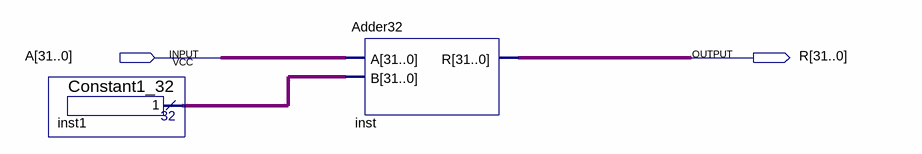
[diagram p0: schematic sheet]
// Quartus schematic Add1.bdf as structural Verilog: 2 symbols, 2 pins
module Add1 (
  input  [31:0] A,
  output [31:0] R
);

  wire [31:0] inst1_result;

  Constant1_32 inst1 (.result(inst1_result));
  Adder32 inst (.A(A), .B(inst1_result), .R(R));
endmodule
